# EAGLE schematic GBxCart_RW_v1.1_Schematic (EAGLE 6.4)
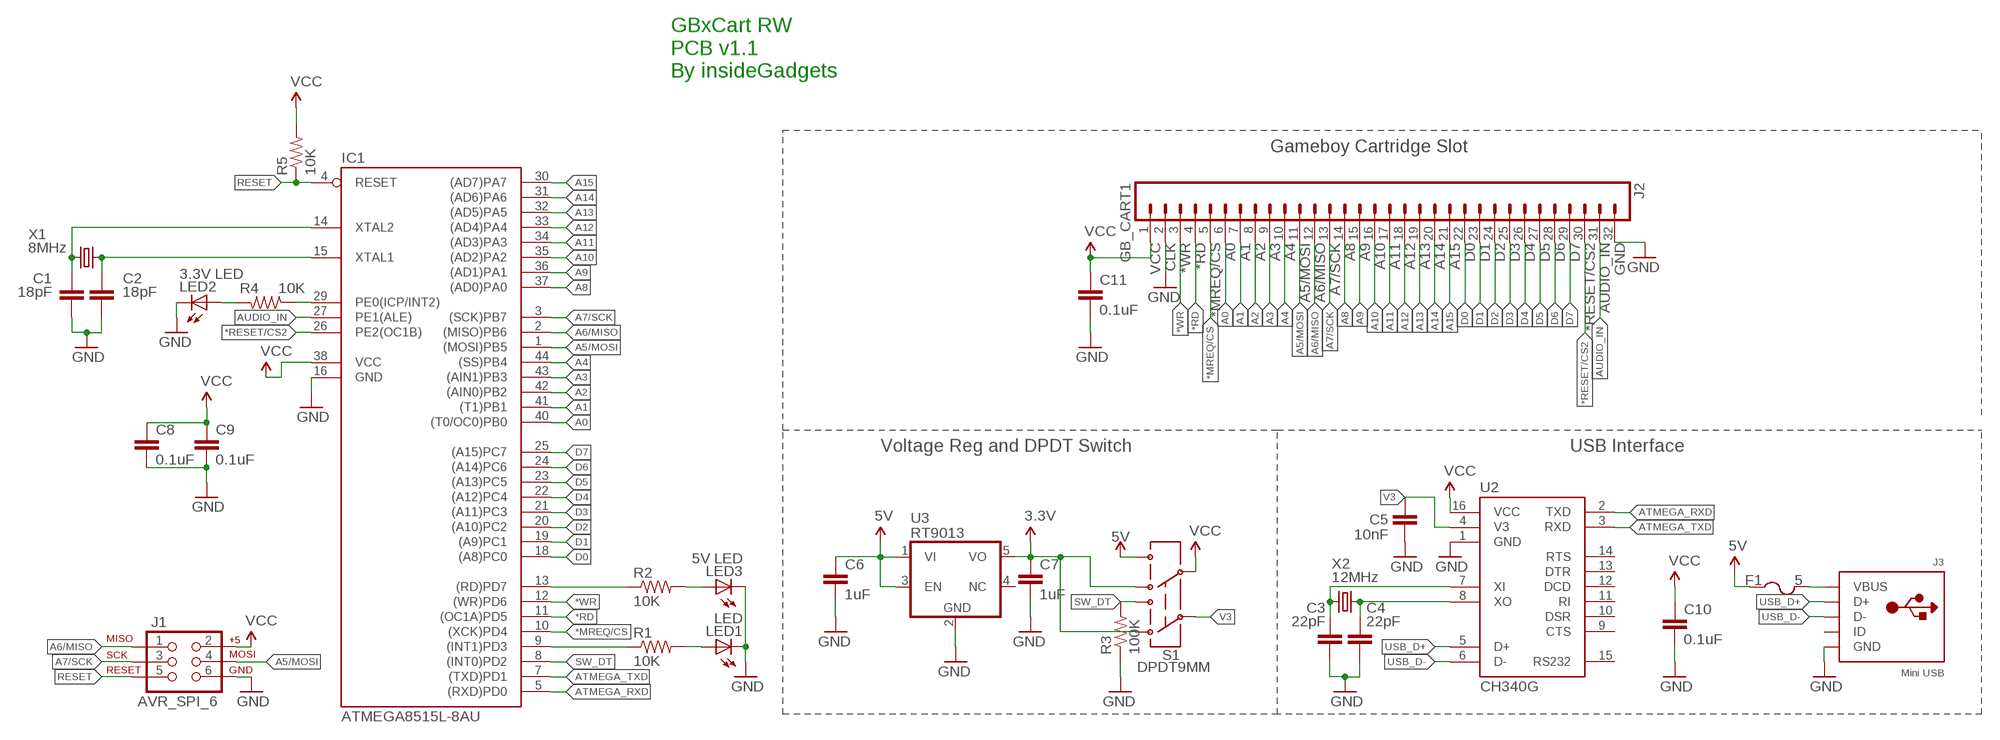
[diagram p0: schematic, sheet 1]

## Parts
C1  18pF  CAP0805  [C0805K]
C2  18pF  CAP0805  [C0805K]
C3  22pF  CAP0805  [C0805K]
C4  22pF  CAP0805  [C0805K]
C5  10nF  CAP0805  [C0805K]
C6  1uF  CAP0805  [C0805K]
C7  1uF  CAP0805  [C0805K]
C8  0.1uF  CAP0805  [C0805K]
C9  0.1uF  CAP0805  [C0805K]
C10  0.1uF  CAP0805  [C0805K]
C11  0.1uF  CAP0805  [C0805K]
F1  5  PTCFUSE-1206  [R1206]
IC1  ATMEGA8515L-8AU  MEGA8515-A  [TQFP44]
J1  AVR_SPI_6  AVR_SPI_PRG_6  [2X3_2]
J2  GB_CART1  [GB_CART_1]
J3  Mini USB  USBMINIB  [USB-MINIB]
LED1  LED  LEDCHIP-LED0805-NS  [CHIP-LED0805-NS]
LED2  3.3V LED  LEDCHIP-LED0805-NS  [CHIP-LED0805-NS]
LED3  5V LED  LEDCHIP-LED0805-NS  [CHIP-LED0805-NS]
R1  10K  R-US_R0805_2  [R0805_2]
R2  10K  R-US_R0805_2  [R0805_2]
R3  100K  R-US_R0805_2  [R0805_2]
R4  10K  R-US_R0805_2  [R0805_2]
R5  10K  R-US_R0603  [R0603]
S1  DPDT9MM  SWITCH-DPDT9MM-DIP  [DPDT-3]
U2  CH340G  [SO16]
U3  RT9013  [SOT23-5L]
X1  8MHz  CRYSTALHC49U-V  [HC49U-V]
X2  12MHz  CRYSTALHC49U-V  [HC49U-V]

## Nets
3.3V: C7.1 S1.1 S1.4 U3.5(VO)
5V: C6.1 F1.1 S1.6 U3.1(VI) U3.3(EN)
*MREQ/CS: IC1.10((XCK)PD4) J2.5
*RD: IC1.11((OC1A)PD5) J2.4
*RESET/CS2: IC1.26(PE2(OC1B)) J2.30
*WR: IC1.12((WR)PD6) J2.3
A0: IC1.40((T0/OC0)PB0) J2.6
A1: IC1.41((T1)PB1) J2.7
A2: IC1.42((AIN0)PB2) J2.8
A3: IC1.43((AIN1)PB3) J2.9
A4: IC1.44((SS)PB4) J2.10
A5/MOSI: IC1.1((MOSI)PB5) J1.4 J2.11
A6/MISO: IC1.2((MISO)PB6) J1.1 J2.12
A7/SCK: IC1.3((SCK)PB7) J1.3 J2.13
A8: IC1.37((AD0)PA0) J2.14
A9: IC1.36((AD1)PA1) J2.15
A10: IC1.35((AD2)PA2) J2.16
A11: IC1.34((AD3)PA3) J2.17
A12: IC1.33((AD4)PA4) J2.18
A13: IC1.32((AD5)PA5) J2.19
A14: IC1.31((AD6)PA6) J2.20
A15: IC1.30((AD7)PA7) J2.21
ATMEGA_RXD: IC1.5((RXD)PD0) U2.2(TXD)
ATMEGA_TXD: IC1.7((TXD)PD1) U2.3(RXD)
AUDIO_IN: IC1.27(PE1(ALE)) J2.31
D0: IC1.18((A8)PC0) J2.22
D1: IC1.19((A9)PC1) J2.23
D2: IC1.20((A10)PC2) J2.24
D3: IC1.21((A11)PC3) J2.25
D4: IC1.22((A12)PC4) J2.26
D5: IC1.23((A13)PC5) J2.27
D6: IC1.24((A14)PC6) J2.28
D7: IC1.25((A15)PC7) J2.29
GND: C1.2 C2.2 C3.2 C4.2 C5.2 C6.2 C7.2 C8.2 C9.2 C10.2 C11.2 IC1.16(GND) J1.6 J2.2 J2.32 J3.GND LED1.C LED2.C LED3.C R3.1 U2.1(GND) U3.2(GND)
N$1: IC1.9((INT1)PD3) R1.1
N$2: LED2.A R4.2
N$5: LED3.A R2.2
N$7: F1.2 J3.VBUS
N$8: IC1.13((RD)PD7) R2.1
N$9: IC1.29(PE0(ICP/INT2)) R4.1
N$18: LED1.A R1.2
RESET: IC1.4(RESET) J1.5 R5.1
SW_DT: IC1.8((INT0)PD2) R3.2 S1.3
USB_D+: J3.D+ U2.5(D+)
USB_D-: J3.D- U2.6(D-)
V3: C5.1 S1.2 U2.4(V3)
VCC: C8.1 C9.1 C10.1 C11.1 IC1.38(VCC) J1.2 J2.1 R5.2 S1.5 U2.16(VCC)
XTAL3: C3.1 U2.7(XI) X2.2
XTAL4: C4.1 U2.8(XO) X2.1
XTAL5: C1.1 IC1.14(XTAL2) X1.2
XTAL6: C2.1 IC1.15(XTAL1) X1.1
Unconnected: IC1.6(NC1) IC1.17(NC2) IC1.28(NC3) IC1.39(NC4) J3.ID U2.9(CTS) U2.10(DSR) U2.11(RI) U2.12(DCD) U2.13(DTR) U2.14(RTS) U2.15(RS232) U3.4(NC)

## Notes on the sheet
- GBxCart RW
  PCB v1.1
  By insideGadgets
- Gameboy Cartridge Slot
- VCC | CLK
- Voltage Reg and DPDT Switch | USB Interface

## Library data of the parts
C1-C11 = adafruit:CAP
F1 = adafruit:PTCFUSE: PTC fuses, resettable thermistors
IC1 = avr-5:MEGA8515: MICROCONTROLLER 8 Kbytes FLASH 512 bytes SRAM 512 bytes EEPROM USART 8-channel 10 bit ADC
J1 = SparkFun:AVR_SPI_PRG_6: AVR ISP 6 Pin This is the reduced ISP connector for AVR programming. Common on Arduino. This footprint will take up less PCB space and can be used with a 10-pin to 6-pin adapter such as SKU: BOB-08508
J2 = alex:GB_CART
J3 = adafruit:USB: USB Connectors USBMINIB - Surface Mount Female Mini-B USB Connector 4UConnector: 06564 By microbuilder.eu Thru-hole RA Female Mini-B USB Connector 4UConnector: 18732 By ladyada.net
LED1-LED3 = adafruit:LED: LED OSRAM: - CHIPLED LG R971, LG N971, LY N971, LG Q971, LY Q971, LO R971, LY R971 LH N974, LH R974 LS Q976, LO Q976, LY Q976 LO Q996 - Hyper CHIPLED LW Q18S LB Q993, LB Q99A, LB R99A - SideLED LS A670, LO A670, LY A670, LG A670, LP A670 LB A673, LV A673, LT A673, LW A673 LH A674 LY A675 LS A676, LA A676, LO A676, LY A676, LW A676 LS A679, LY A679, LG A679 - Hyper Micro SIDELED® LS Y876, LA Y876, LO Y876, LY Y876 LT Y87S - SmartLED LW L88C, LW L88S LB L89C, LB L89S, LG L890 LS L89K, LO L89K, LY L89K LS L896, LA L896, LO L896, LY L896 - TOPLED LS T670, LO T670, LY T670, LG T670, LP T670 LSG T670, LSP T670, LSY T670, LOP T670, LYG T670 LG T671, LOG T671, LSG T671 LB T673, LV T673, LT T673, LW T673 LH T674 LS T676, LA T676, LO T676, LY T676, LB T676, LH T676, LSB T676, LW T676 LB T67C, LV T67C, LT T67C, LS T67K, LO T67K, LY T67K, LW E67C LS E67B, LA E67B, LO E67B, LY E67B, LB E67C, LV E67C, LT E67C LW T67C LS T679, LY T679, LG T679 LS T770, LO T770, LY T770, LG T770, LP T770 LB T773, LV T773, LT T773, LW T773 LH T774 LS E675, LA E675, LY E675, LS T675 LS T776, LA T776, LO T776, LY T776, LB T776 LHGB T686 LT T68C, LB T68C - Hyper Mini TOPLED® LB M676 - Mini TOPLED Santana® LG M470 LS M47K, LO M47K, LY M47K Source: http://www.osram.convergy.de/
R1-R5 = adafruit:R-US_: RESISTOR, American symbol
S1 = SparkFun:SWITCH-DPDT: DPDT Version of the COM-00597
U2 = alex:CH340G
U3 = adafruit:RT9013
X1 X2 = crystal:CRYSTAL: CRYSTAL